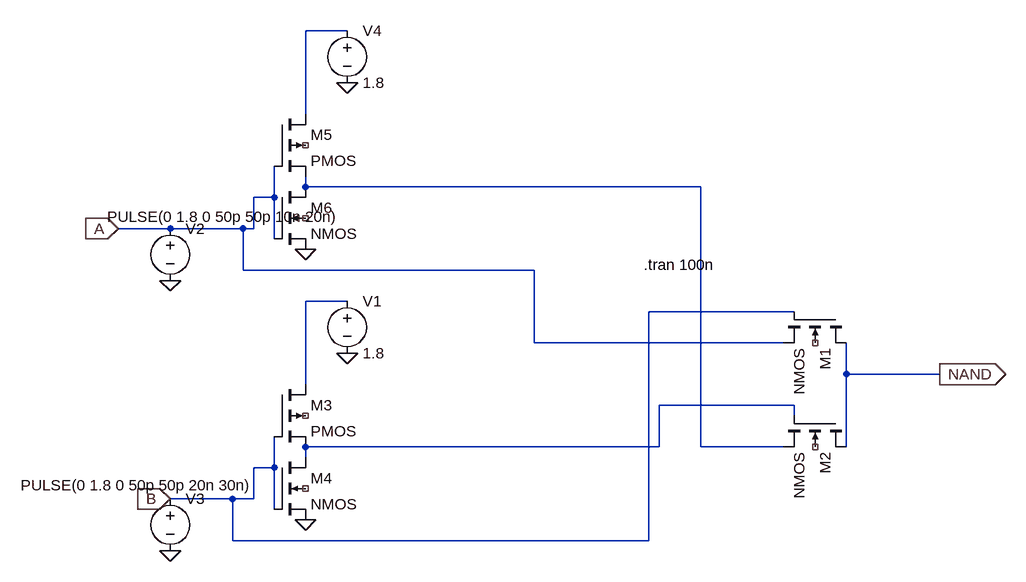
[diagram p0: schematic XNOR.asc]
XNOR.asc, the LTspice schematic file:
Version 4.1
SHEET 1 880 680
WIRE -208 -384 -272 -384
WIRE -272 -256 -272 -384
WIRE -272 -144 -272 -160
WIRE 336 -144 -272 -144
WIRE -320 -128 -320 -176
WIRE -320 -128 -352 -128
WIRE -480 -80 -560 -80
WIRE -368 -80 -480 -80
WIRE -352 -80 -352 -128
WIRE -352 -80 -368 -80
WIRE -320 -64 -320 -128
WIRE -368 -16 -368 -80
WIRE 80 -16 -368 -16
WIRE -208 32 -272 32
WIRE 480 48 256 48
WIRE 80 96 80 -16
WIRE 464 96 80 96
WIRE 560 144 560 96
WIRE 704 144 560 144
WIRE -272 160 -272 32
WIRE 480 192 272 192
WIRE 480 208 480 192
WIRE 272 256 272 192
WIRE 272 256 -272 256
WIRE 336 256 336 -144
WIRE 464 256 336 256
WIRE 560 256 560 144
WIRE -272 272 -272 256
WIRE -320 288 -320 240
WIRE -320 288 -352 288
WIRE -384 336 -480 336
WIRE -352 336 -352 288
WIRE -352 336 -384 336
WIRE -320 352 -320 288
WIRE -384 400 -384 336
WIRE 256 400 256 48
WIRE 256 400 -384 400
FLAG -208 112 0
FLAG -480 0 0
FLAG -480 416 0
FLAG 704 144 NAND
IOPIN 704 144 Out
FLAG -560 -80 A
IOPIN -560 -80 In
FLAG -480 336 B
IOPIN -480 336 In
FLAG -272 368 0
FLAG -208 -304 0
FLAG -272 -48 0
SYMBOL nmos4 560 48 R90
SYMATTR InstName M1
SYMBOL nmos4 560 208 R90
SYMATTR InstName M2
SYMBOL pmos4 -320 160 R0
SYMATTR InstName M3
SYMBOL nmos4 -320 272 R0
SYMATTR InstName M4
SYMBOL voltage -208 16 R0
WINDOW 123 0 0 Left 0
WINDOW 39 0 0 Left 0
SYMATTR InstName V1
SYMATTR Value 1.8
SYMBOL voltage -480 -96 R0
WINDOW 3 -97 -2 Left 2
WINDOW 123 0 0 Left 0
WINDOW 39 0 0 Left 0
SYMATTR Value PULSE(0 1.8 0 50p 50p 10n 20n)
SYMATTR InstName V2
SYMBOL voltage -480 320 R0
WINDOW 3 -230 -5 Left 2
WINDOW 123 0 0 Left 0
WINDOW 39 0 0 Left 0
SYMATTR Value PULSE(0 1.8 0 50p 50p 20n 30n)
SYMATTR InstName V3
SYMBOL pmos4 -320 -256 R0
SYMATTR InstName M5
SYMBOL nmos4 -320 -144 R0
SYMATTR InstName M6
SYMBOL voltage -208 -400 R0
WINDOW 123 0 0 Left 0
WINDOW 39 0 0 Left 0
SYMATTR InstName V4
SYMATTR Value 1.8
TEXT 248 -24 Left 2 !.tran 100n

The netlist it stands for:
* XNOR.asc
M1 NAND B A NC_01 NMOS
M2 NAND N004 N002 NC_02 NMOS
M3 N003 B N004 NC_03 PMOS
M4 N004 B 0 NC_04 NMOS
V1 N003 0 1.8
V2 A 0 PULSE(0 1.8 0 50p 50p 10n 20n)
V3 B 0 PULSE(0 1.8 0 50p 50p 20n 30n)
M5 N001 A N002 NC_05 PMOS
M6 N002 A 0 NC_06 NMOS
V4 N001 0 1.8
.model NMOS NMOS
.model PMOS PMOS
.lib standard.mos
.tran 100n
.backanno
.end